# EAGLE design Li-Ion_Pol Battery Charger Mod Schematic (EAGLE 9.6.2)
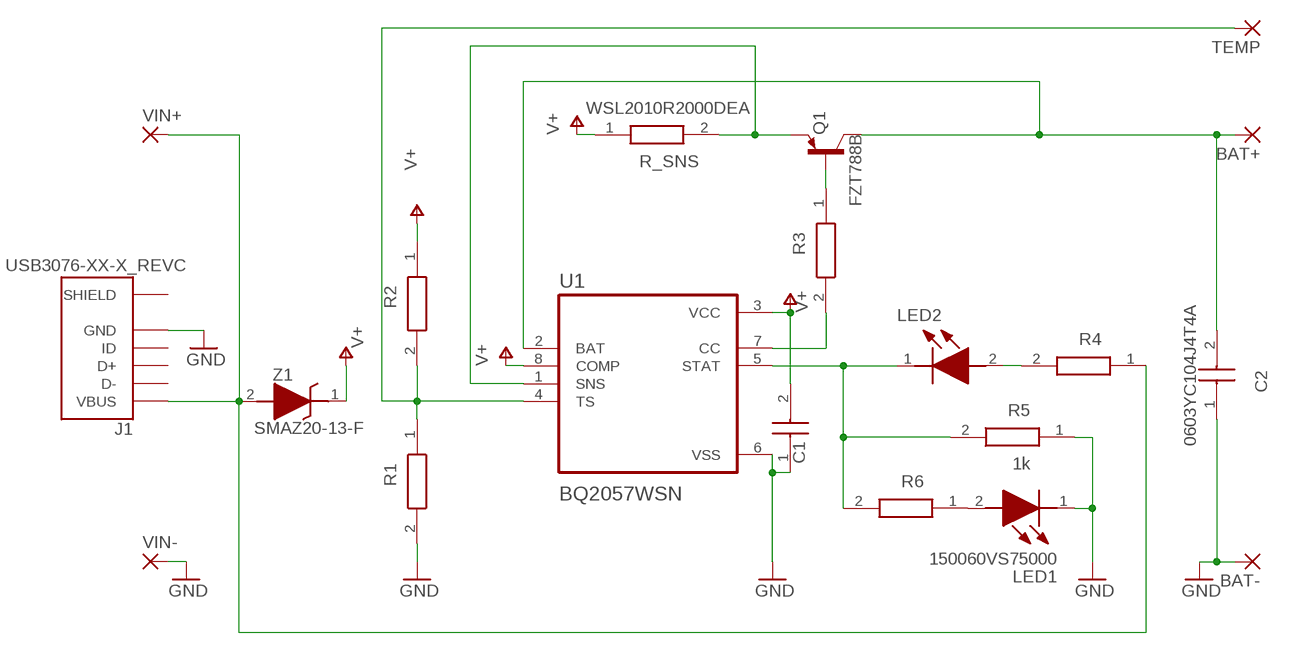
[diagram p0: schematic, sheet 1]

## Parts
BAT+  3,17/1,3  [3,17/1,3]
BAT-  3,17/1,3  [3,17/1,3]
C1  0603YC104J4T4A  [CAPC1608X90N]
C2  0603YC104J4T4A  [CAPC1608X90N]
J1  USB3076-XX-X_REVC  [GCT_USB3076-XX-X_REVC]
LED1  150060VS75000  [LEDC1608X80N]
LED2  150060VS75000  [LEDC1608X80N]
Q1  FZT788B  [SOT230P700X165-4N]
R1  1k  RS73F1JTTD1001B  [RESC1608X55N]
R2  RS73F1JTTD1001B  [RESC1608X55N]
R3  RS73F1JTTD1001B  [RESC1608X55N]
R4  RS73F1JTTD1001B  [RESC1608X55N]
R5  1k  RS73F1JTTD1001B  [RESC1608X55N]
R6  RS73F1JTTD1001B  [RESC1608X55N]
R_SNS  WSL2010R2000DEA  [RESC5125X89N]
TEMP  3,17/1,3  [3,17/1,3]
U1  BQ2057WSN  [SOIC127P599X175-8N]
VIN+  3,17/1,3  [3,17/1,3]
VIN-  3,17/1,3  [3,17/1,3]
Z1  SMAZ20-13-F  [DIOM5226X240N]

## Nets
GND: BAT-.1(P) C1.1 C2.1 J1.5(GND) LED1.1(K) R1.2 R5.1 U1.6(VSS) VIN-.1(P)
N$1: LED2.1(K) R5.2 R6.2 U1.5(STAT)
N$2: LED2.2(A) R4.2
N$3: LED1.2(A) R6.1
N$5: Q1.1(B) R3.1
N$6: BAT+.1(P) C2.2 Q1.2(C) Q1.4(C) U1.2(BAT)
N$7: R3.2 U1.7(CC)
N$8: R1.1 R2.2 TEMP.1(P) U1.4(TS)
N$10: Q1.3(E) R_SNS.2 U1.1(SNS)
N$11: J1.1(VBUS) R4.1 VIN+.1(P) Z1.2(A)
V+: C1.2 R2.1 R_SNS.1 U1.3(VCC) U1.8(COMP) Z1.1(K)
Unconnected: J1.2(D-) J1.3(D+) J1.4(ID)

## Power pins joined to a net without a drawn wire
SHIELD: J1.6(SHIELD) J1.7(SHIELD) J1.8(SHIELD) J1.9(SHIELD) J1.10(SHIELD) J1.11(SHIELD)

## Library data of the parts
BAT+ BAT- TEMP VIN+ VIN- = wirepad:3,17/1,3: THROUGH-HOLE PAD
C1 C2 = SamacSys_Parts:0603YC104J4T4A: Multilayer Ceramic Capacitors MLCC - SMD/SMT 16V .1uF X7R 0603 Tol 5% AEC-Q200 Source: Datasheet <https://componentsearchengine.com/Datasheets/1/06031A100FAT2A.pdf>; DESCRIPTION: Multilayer Ceramic Capacitors MLCC - SMD/SMT 16V .1uF X7R 0603 Tol 5% AEC-Q200; HEIGHT: 0.9mm; MANUFACTURER_NAME: AVX; MANUFACTURER_PART_NUMBER: 0603YC104J4T4A; MOUSER_PART_NUMBER: 581-0603YC104J4T4A; MOUSER_PRICE-STOCK: https://www.mouser.co.uk/ProductDetail/AVX/0603YC104J4T4A?qs=Cej1j9ztgjFyuPBXcKRKGA%3D%3D
J1 = USB3076-XX-X_REVC (1):USB3076-XX-X_REVC: Micro USB Receptacle, Type B, SMT, Horizontal, Bottom Mount w/out Peg, w/out Shell Stakes, w/out Mating Face Lead-In Check prices <https://pricing.snapeda.com/parts/USB3076-30-A/Global%20Connector%20Technology/view-part?ref=eda>; AVAILABILITY: In Stock; DESCRIPTION: USB - micro B USB 2.0 Receptacle Connector 5 Position Surface Mount, Right Angle; Through Hole, 2.35mm profile, 5 Pins, Horizontal, Bottom mount; MF: Global Connector Technology; MP: USB3076-30-A; PACKAGE: None; PRICE: None; PURCHASE-URL: https://pricing.snapeda.com/search/part/USB3076-30-A/?ref=eda
LED1 LED2 = SamacSys_Parts:150060VS75000: 2.4 V Green LED 1608 (0603) SMD, Wurth Elektronik WL-SMCW 150060VS75000 Source: Datasheet <https://componentsearchengine.com/Datasheets/2/150060VS75000.pdf>; DESCRIPTION: 2.4 V Green LED 1608 (0603) SMD, Wurth Elektronik WL-SMCW 150060VS75000; HEIGHT: 0.8mm; MANUFACTURER_NAME: Wurth Elektronik; MANUFACTURER_PART_NUMBER: 150060VS75000; MOUSER_PART_NUMBER: 710-150060VS75000; MOUSER_PRICE-STOCK: https://www.mouser.co.uk/ProductDetail/Wurth-Elektronik/150060VS75000?qs=LlUlMxKIyB1Q1Bi5mQ%2FKLw%3D%3D
Q1 = FZT788B:FZT788B: Power transistor SOT-223 PNP -15 V Check prices <https://pricing.snapeda.com/parts/FZT788B/Pericom/view-part?ref=eda>; AVAILABILITY: In Stock; DESCRIPTION: Bipolar (BJT) Transistor PNP 15V 3A 100MHz 2W Surface Mount SOT-223; MF: Pericom; MP: FZT788B; PACKAGE: SOT-223 Pericom; PRICE: None; PURCHASE-URL: https://pricing.snapeda.com/search/part/FZT788B/?ref=eda
R1-R6 = SamacSys_Parts:RS73F1JTTD1001B: 1k 0603 Thick Film Resistor +/-0.1% 0.125W RS73F1JTTD1001B Source: Datasheet <https://www.koaspeer.com/pdfs/RS73.pdf>; DESCRIPTION: 1k 0603 Thick Film Resistor +/-0.1% 0.125W RS73F1JTTD1001B; HEIGHT: 0.55mm; MANUFACTURER_NAME: KOA Speer; MANUFACTURER_PART_NUMBER: RS73F1JTTD1001B; MOUSER_PART_NUMBER: 660-RS73F1JTTD1001B; MOUSER_PRICE-STOCK: https://www.mouser.co.uk/ProductDetail/KOA-Speer/RS73F1JTTD1001B/?qs=T3oQrply3y8aE4%252Bzjei0NA%3D%3D
R_SNS = SamacSys_Parts:WSL2010R2000DEA: Current Sense Resistors - SMD 1/2watt .2ohms .5% Source: Datasheet; DESCRIPTION: Current Sense Resistors - SMD 1/2watt .2ohms .5%; HEIGHT: 0.889mm; MANUFACTURER_NAME: Vishay; MANUFACTURER_PART_NUMBER: WSL2010R2000DEA
U1 = BQ2057WSN:BQ2057WSN: Check prices <https://pricing.snapeda.com/parts/BQ2057WSN/Texas%20Instruments/view-part?ref=eda>; AVAILABILITY: In Stock; DESCRIPTION: Low Dropout linear 2-cell Li-ion charge controller with AutoCompTM, 8.4V 8-SOIC -20 to 70; MF: Texas Instruments; MP: BQ2057WSN; PACKAGE: SOIC-8 Texas Instruments; PRICE: None; PURCHASE-URL: https://pricing.snapeda.com/search/part/BQ2057WSN/?ref=eda
Z1 = SamacSys_Parts:SMAZ20-13-F: Diodes Inc Zener Diode, 20V 5% 1 W SMT 2-Pin SMA Source: Datasheet <https://www.diodes.com/assets/Datasheets/ds18015.pdf>; DESCRIPTION: Diodes Inc Zener Diode, 20V 5% 1 W SMT 2-Pin SMA; HEIGHT: 2.4mm; MANUFACTURER_NAME: Diodes Inc.; MANUFACTURER_PART_NUMBER: SMAZ20-13-F; MOUSER_PART_NUMBER: 621-SMAZ20-F; MOUSER_PRICE-STOCK: https://www.mouser.co.uk/ProductDetail/Diodes-Incorporated/SMAZ20-13-F?qs=mGuGFjoQO74YkW4BGqah5A%3D%3D

## Board
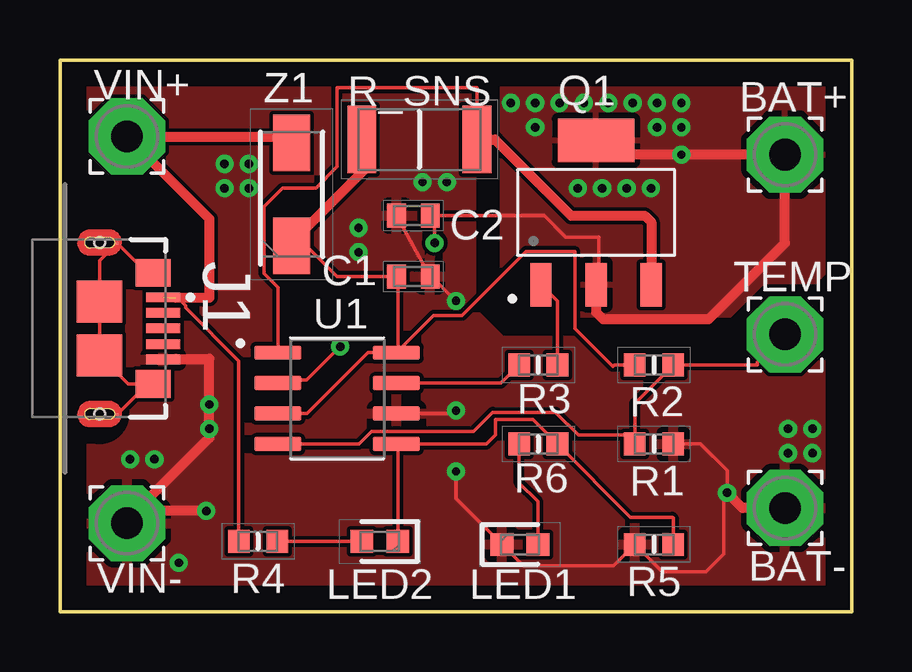
[diagram p1: board, top side]
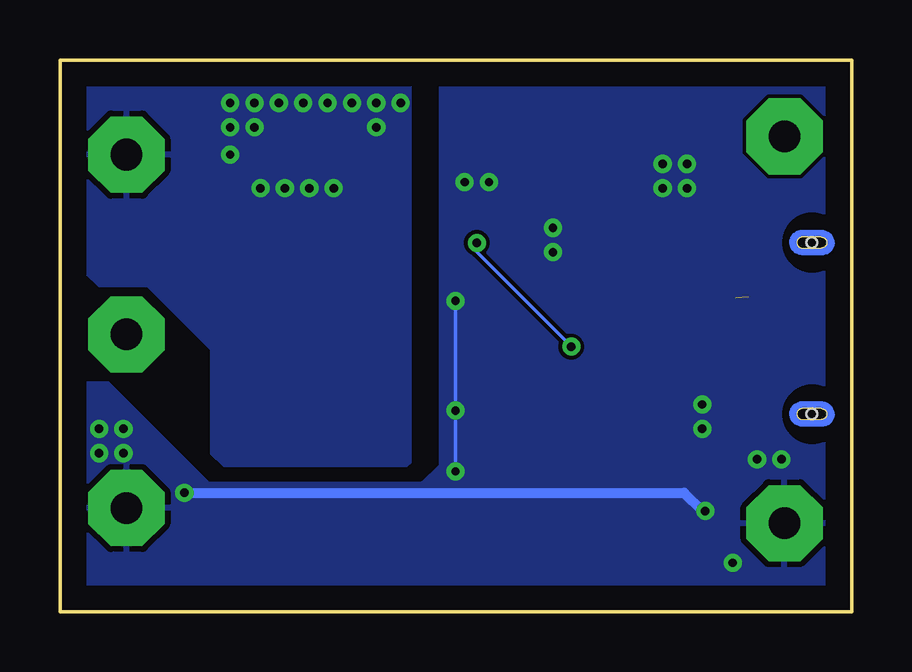
[diagram p2: board, bottom side, seen from below]

Size 33 x 23 mm. Coordinates in mm from the lower left corner, seen from the top.
Outline: 0,0 33,0 33,23 0,23 0,0
Copper layers (1*16): Top 0.035mm / dielectric 1.5mm / Bottom 0.035mm
Design rules "default": minimum track width 6mil, minimum drill 0.35mm, track to track 6mil, track to pad 6mil, pad to pad 6mil, via to via 6mil, smd to smd 6mil, copper to edge 40mil, drill to drill 6mil, minimum pad ring 10mil, minimum via ring 8mil, stop-mask expansion 4mil, vias tented up to drill 0mil, thermal gap 10mil

### Footprints (pad centres in the part's own frame; a part is rotated, then mirrored left to right if it is on the bottom)
3,17/1,3 = drill 1.321 pad 3.175 octagon: 1 0,0
CAPC1608X90N = smd 0.78 x 0.99: 1 -0.7,0; 2 0.7,0
GCT_USB3076-XX-X_REVC = smd 0.4 x 1.4: 1 -1.3,2.65; 2 -0.65,2.65; 3 0,2.65; 4 0.66,2.65; 5 1.3,2.65 | smd 0.1 x 0.1: 6 -3.549,0.73; 7 3.601,0.73 | smd 1.15 x 1.45: 8 -2.32,2.23; 9 2.32,2.23 | smd 1.75 x 1.9: 10 -1.125,0; 11 1.125,0 | hole 0.45: -3.575,0; 3.575,0
LEDC1608X80N = smd 0.95 x 0.95: 1 -0.75,0; 2 0.75,0
SOT230P700X165-4N = smd 1.81 x 0.89: 1 -3.01,2.3; 2 -3.01,0; 3 -3.01,-2.3 | smd 1.81 x 3.19: 4 3.01,0
RESC1608X55N = smd 0.9 x 0.95: 1 -0.8,0; 2 0.8,0
RESC5125X89N = smd 1.2 x 2.8: 1 -2.4,0; 2 2.4,0
SOIC127P599X175-8N = smd 1.97 x 0.6: 1 -2.47,1.905; 2 -2.47,0.635; 3 -2.47,-0.635; 4 -2.47,-1.905; 5 2.47,-1.905; 6 2.47,-0.635; 7 2.47,0.635; 8 2.47,1.905
DIOM5226X240N = smd 2.35 x 1.55: 1 -2.15,0; 2 2.15,0

### Placement (x,y rotation side)
BAT+  30.23,19.05 0 top
BAT-  30.23,4.32 0 top
C1  14.73,13.97 180 top
C2  14.73,16.51 0 top
J1  1.65,11.81 270 top
LED1  19.18,2.79 0 top
LED2  13.34,2.92 180 top
Q1  22.35,16.64 90 top
R1  24.77,6.99 0 top
R2  24.77,10.29 0 top
R3  19.94,10.29 180 top
R4  8.26,2.92 0 top
R5  24.77,2.79 0 top
R6  19.94,6.99 0 top
R_SNS  14.99,19.68 0 top
TEMP  30.23,11.56 0 top
U1  11.56,8.89 0 top
VIN+  2.79,19.81 0 top
VIN-  2.79,3.68 0 top
Z1  9.65,17.4 90 top

### Tracks (layer width: path | path; a pad name or v marks a point on that pad's centre or on a via)
GND  (via drill 0.35)
  Top 0.152: v16.51,5.84 16.51,4.71 LED1.1 19.32,1.91 23.08,1.91 R5.1 25.11,1.65 26.92,1.65 27.69,2.41 27.69,4.95 v27.81,4.95 27.81,5.88 26.71,6.99 R1.2 | v16.51,8.38 16.38,8.26 U1.6 | C2.1 C1.1 15.49,13.97 v16.51,12.95
  Top 0.406: VIN-.1 2.79,3.81 3.24,4.25 | 4.83,10.54 6.22,10.54 v6.22,8.64 v6.22,7.62 6.22,7.24 3.24,4.25 | BAT-.1 28.45,4.32 v27.81,4.95 | v6.1,4.19 3.3,4.19 3.24,4.25
  Bottom 0.152: v16.51,5.84 v16.51,8.38 v16.51,12.95
  Bottom 0.406: v27.81,4.95 6.99,4.95 6.22,4.19 v6.1,4.19
  other vias: 6.86,18.67 7.87,18.67 7.87,17.65 6.86,17.65 3.94,6.35 2.92,6.35 4.95,2.03 30.35,7.62 31.37,6.6 30.35,6.6 31.37,7.62 12.45,16 12.45,14.99 15.11,17.91 16.13,17.91
  pour Top: 0.13,22.86 17.14,22.86 17.14,12.57 18.41,11.3 32.89,11.3 32.89,0.13 0.13,0.13
  pour Bottom: 0.13,22.86 17.14,22.86 17.14,6.1 17.91,5.33 26.8,5.33 30.99,9.53 32.77,9.53 32.89,9.4 32.89,0.25 32.77,0.13 0.13,0.13
N$1
  Top 0.152: LED2.1 14.09,6.93 U1.5 17.78,6.99 18.16,7.37 18.16,8 19.72,8 R6.2 23.79,3.94 25.53,3.94 25.57,3.9 R5.2
N$2
  Top 0.152: R4.2 LED2.2
N$3
  Top 0.152: LED1.2 19.93,4.58 19.14,5.37 R6.1
N$5
  Top 0.152: Q1.1 20.74,12.94 R3.1
N$6  (via drill 0.35)
  Top 0.152: U1.2 9.21,9.65 10.29,9.65 v11.68,11.05 | v15.62,15.37 15.62,16.32 C2.2 20.19,16.51 21.08,15.62 22.48,15.62 22.48,13.75 Q1.2
  Top 0.406: Q1.4 22.95,19.05 v25.91,19.05 BAT+.1 30.23,15.37 27.05,12.19 22.64,12.19 22.35,12.48 Q1.2
  Bottom 0.152: v11.68,11.05 15.62,14.99 v15.62,15.37
  other vias: 21.59,17.65 22.61,17.65 23.62,17.65 24.64,17.65 24.89,20.19 25.91,20.19 25.91,21.21 24.89,21.21 19.81,20.19 18.8,21.21 19.81,21.21 20.83,21.21 21.84,21.21 22.86,21.21 23.88,21.21
  pour Top: 18.41,22.23 31.62,22.23 32.26,21.59 32.26,14.48 31.5,13.72 29.34,13.72 27.94,12.32 18.41,12.32
  pour Bottom: 18.41,21.97 18.41,6.22 18.54,6.1 26.16,6.1 26.67,6.6 26.67,10.92 29.34,13.59 31.37,13.59 31.88,14.1 31.88,21.97
N$7
  Top 0.152: U1.7 18.38,9.53 R3.2
N$8
  Top 0.152: TEMP.1 29.08,10.41 29.08,10.29 R2.2 23.96,8.69 23.96,7.37 | R1.1 23.96,7.37 | U1.4 12.46,6.99 12.99,7.51 17.24,7.51 18.04,8.31 20.67,8.31 21.61,7.37 23.96,7.37
N$10
  Top 0.152: U1.1 9.09,13.52 8.51,14.1 8.51,16.89 9.27,17.65 10.67,17.65 11.56,18.54 11.56,21.84 17.39,21.84 R_SNS.2
  Top 0.406: R_SNS.2 18.14,19.68 21.31,16.51 24.38,16.51 24.65,16.24 Q1.3
N$11  (1 unrouted)
  Top 0.152: J1.1 4.87,13.11 5.23,12.76 5.23,12.68 7.46,10.45 R4.1
  Top 0.406: 4.83,13.08 6.22,13.08 6.22,16.38 VIN+.1 9.39,19.81 Z1.2
SHIELD
  Top 0.152: J1.7 3.66,9.49 J1.9 2.85,9.49 J1.11 J1.10 1.65,12.95 1.65,14.63 J1.6 3.61,14.13 J1.8
V+
  Top 0.152: 14.1,10.87 U1.8 12.84,10.79 10.3,8.26 U1.3 | 14.1,10.87 14.1,13.97 C1.2 11.56,13.97 9.96,15.56 9.9,15.63 | R2.1 23.11,10.29 23.05,10.22 21.46,11.81 21.46,15.02 19.43,15.02 16.76,12.35 15.58,12.35 14.1,10.87
  Top 0.406: Z1.1 9.96,15.56 | 9.9,15.63 12.98,18.7 12.59,18.96 R_SNS.1